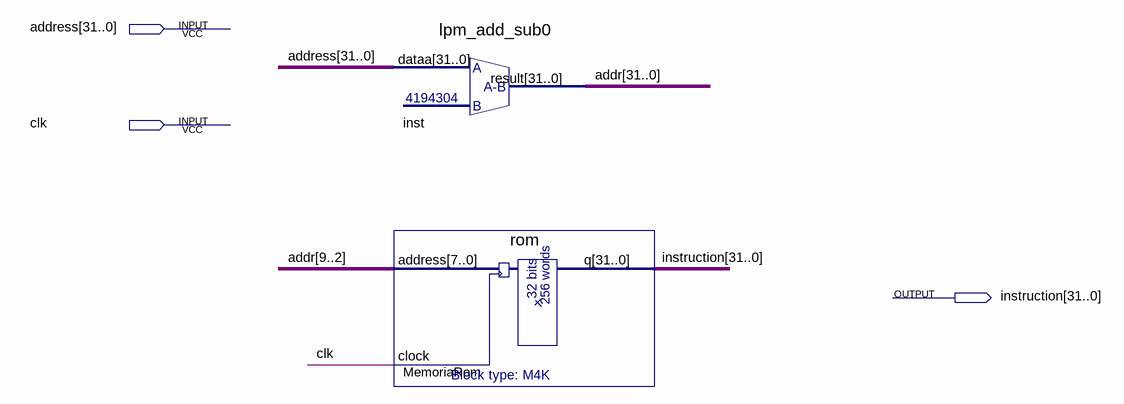
[diagram p0: schematic sheet]
// Quartus schematic instruction_memory.bdf as structural Verilog: 2 symbols, 3 pins
module instruction_memory (
  input  [31:0] address,
  input  clk,
  output [31:0] instruction
);

  wire [31:0] addr;

  lpm_add_sub0 inst (.dataa(address), .result(addr));
  rom MemoriaRom (.address(addr[9:2]), .clock(clk), .q(instruction));
endmodule
